# EAGLE design TimerSchematicV1 (EAGLE 9.6.2)
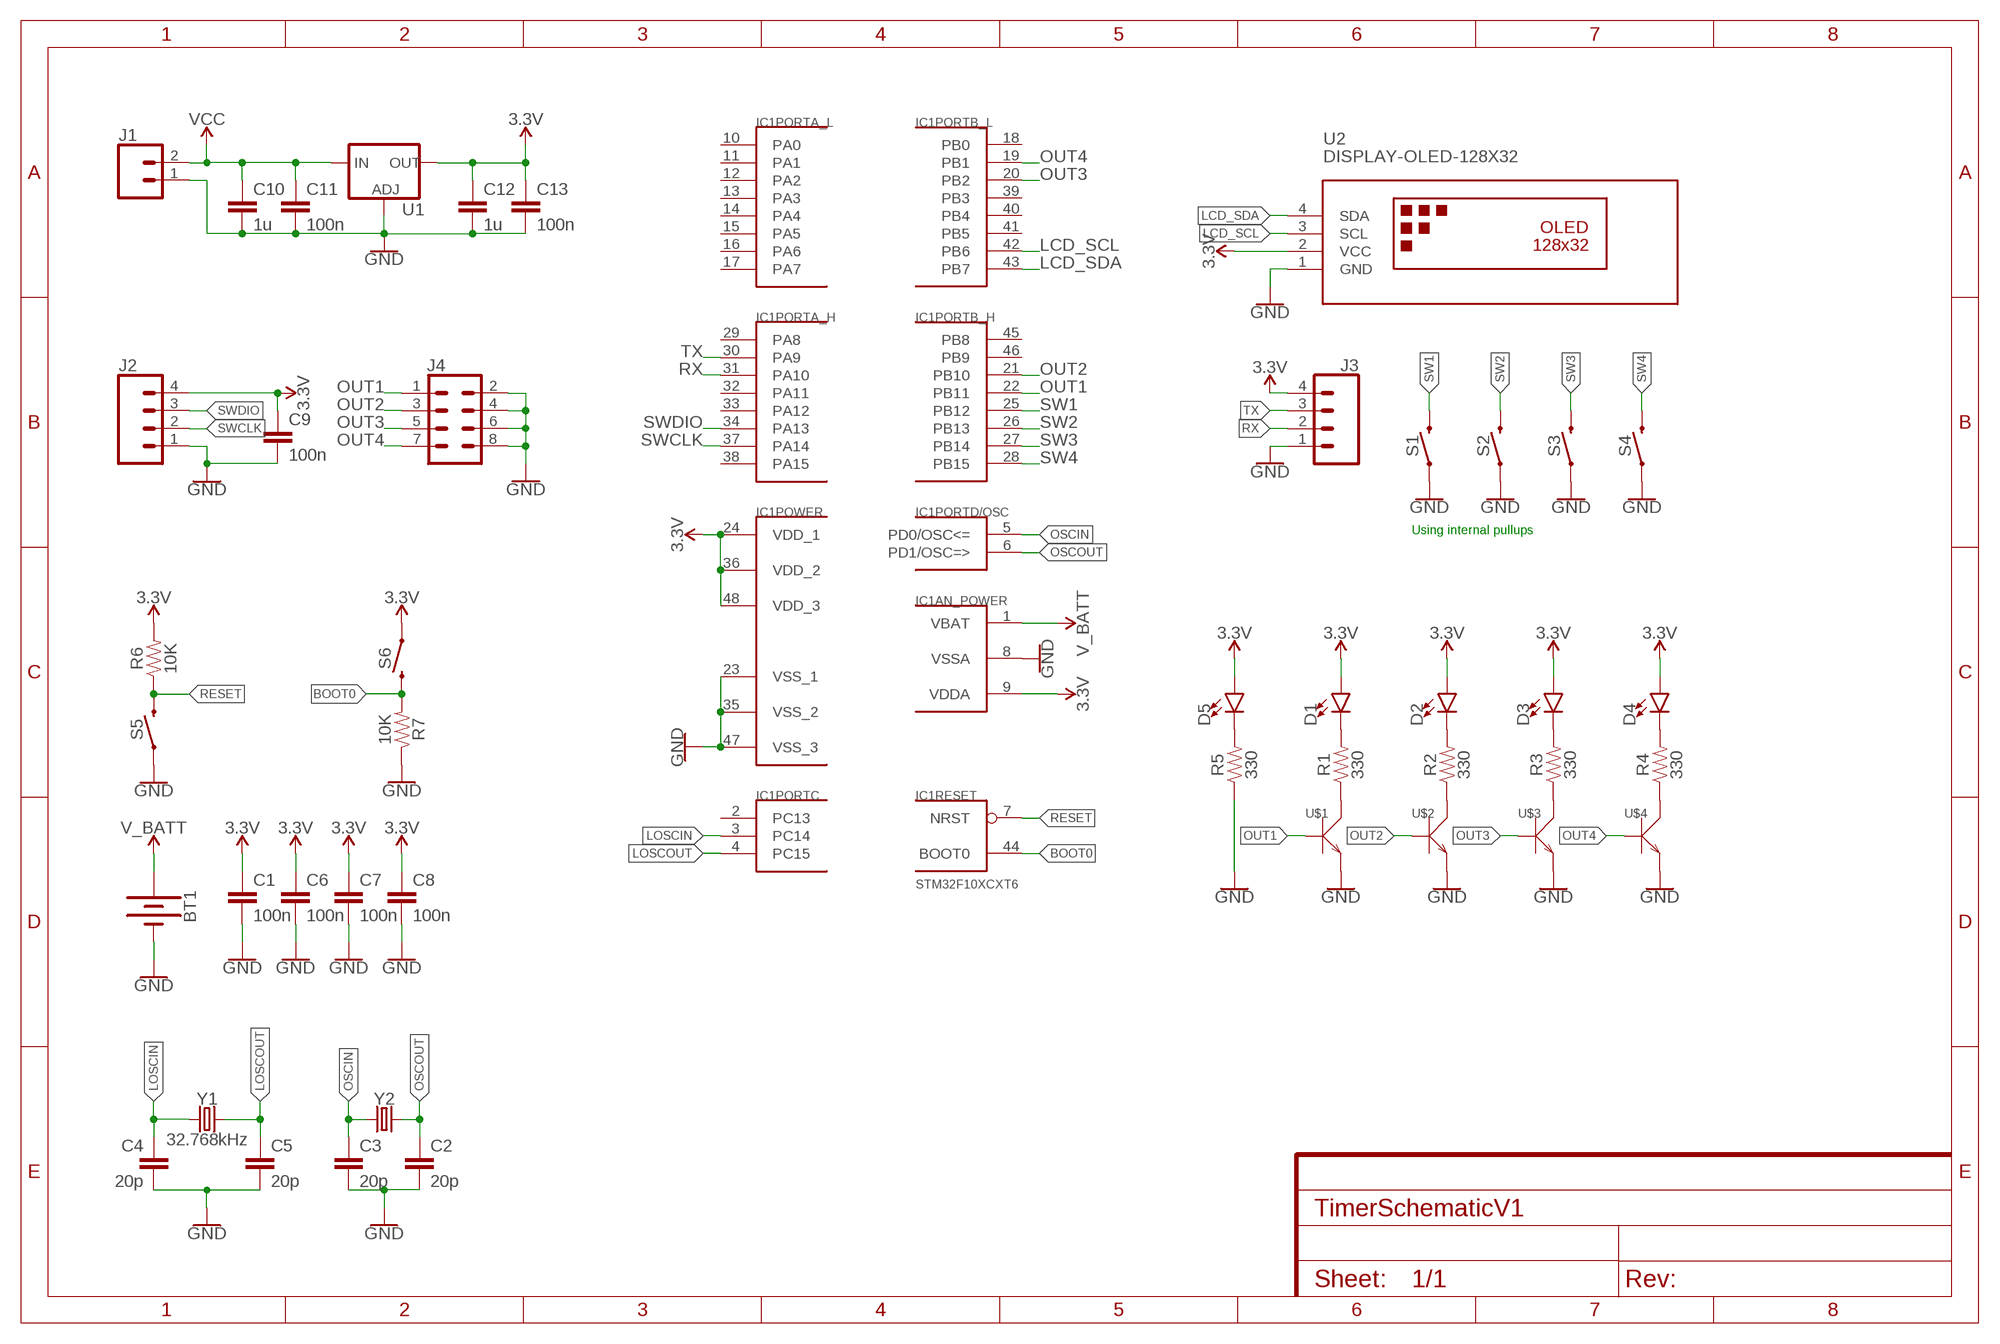
[diagram p0: schematic, sheet 1]

## Parts
BT1  BATTERY-20MM_PTH  [BATTCOM_20MM_PTH]
C1  100n  CAP-1206  [1206]
C2  20p  CAP-1206  [1206]
C3  20p  CAP-1206  [1206]
C4  20p  CAP-1206  [1206]
C5  20p  CAP-1206  [1206]
C6  100n  CAP-1206  [1206]
C7  100n  CAP-1206  [1206]
C8  100n  CAP-1206  [1206]
C9  100n  CAP-1206  [1206]
C10  1u  CAP-1206  [1206]
C11  100n  CAP-1206  [1206]
C12  1u  CAP-1206  [1206]
C13  100n  CAP-1206  [1206]
D1  LED1206  [LED-1206]
D2  LED1206  [LED-1206]
D3  LED1206  [LED-1206]
D4  LED1206  [LED-1206]
D5  LED1206  [LED-1206]
IC1  STM32F10XCXT6  [TQFP48]
J1  CONN_02  [1X02]
J2  CONN_04PTH  [1X04]
J3  CONN_04PTH  [1X04]
J4  CONN_04X2  [2X4]
R1  330  RESISTOR1206  [1206]
R2  330  RESISTOR1206  [1206]
R3  330  RESISTOR1206  [1206]
R4  330  RESISTOR1206  [1206]
R5  330  RESISTOR1206  [1206]
R6  10K  RESISTOR1206  [1206]
R7  10K  RESISTOR1206  [1206]
S1  MOMENTARY-SWITCH-SPST-PTH-6.0MM-KIT  [TACTILE_SWITCH_PTH_6.0MM_KIT]
S2  MOMENTARY-SWITCH-SPST-PTH-6.0MM-KIT  [TACTILE_SWITCH_PTH_6.0MM_KIT]
S3  MOMENTARY-SWITCH-SPST-PTH-6.0MM-KIT  [TACTILE_SWITCH_PTH_6.0MM_KIT]
S4  MOMENTARY-SWITCH-SPST-PTH-6.0MM-KIT  [TACTILE_SWITCH_PTH_6.0MM_KIT]
S5  MOMENTARY-SWITCH-SPST-SMD-6.0X3.5MM  [TACTILE_SWITCH_SMD_6.0X3.5MM]
S6  MOMENTARY-SWITCH-SPST-SMD-6.0X3.5MM  [TACTILE_SWITCH_SMD_6.0X3.5MM]
U1  V_REG_LM1117SOT223  [SOT223]
U2  DISPLAY-OLED-128X32  [DISPLAY-OLED-128X32]
U$1  MMBT3904LT1G  SMD-TRANSISTORS-NPN-40V-200MA-MMBT3904LT1G(SOT-23)  [SOT-23]
U$2  MMBT3904LT1G  SMD-TRANSISTORS-NPN-40V-200MA-MMBT3904LT1G(SOT-23)  [SOT-23]
U$3  MMBT3904LT1G  SMD-TRANSISTORS-NPN-40V-200MA-MMBT3904LT1G(SOT-23)  [SOT-23]
U$4  MMBT3904LT1G  SMD-TRANSISTORS-NPN-40V-200MA-MMBT3904LT1G(SOT-23)  [SOT-23]
Y1  32.768kHz  CRYSTAL-32.768KHZPTH-2X6-KIT  [CRYSTAL-PTH-2X6-CYL-KIT]
Y2  CRYSTALSMD-HC49UP  [HC49UP]

## Nets
3.3V: C1.1 C6.1 C7.1 C8.1 C9.1 C12.1 C13.1 D1.A D2.A D3.A D4.A D5.A IC1.9(AN_POWER:VDDA) IC1.24(POWER:VDD_1) IC1.36(POWER:VDD_2) IC1.48(POWER:VDD_3) J2.4 J3.4 R6.2 S6.1 U1.2(OUT) U1.4(OUT) U2.2(VCC)
BOOT0: IC1.44(RESET:BOOT0) R7.2 S6.2
GND: BT1.2(-) C1.2 C2.2 C3.2 C4.2 C5.2 C6.2 C7.2 C8.2 C9.2 C10.2 C11.2 C12.2 C13.2 IC1.8(AN_POWER:VSSA) IC1.23(POWER:VSS_1) IC1.35(POWER:VSS_2) IC1.47(POWER:VSS_3) J1.1 J2.1 J3.1 J4.2 J4.4 J4.6 J4.8 R5.1 R7.1 S1.1 S2.1 S3.1 S4.1 S5.1 U1.1(ADJ) U2.1(GND) U$1.2(E) U$2.2(E) U$3.2(E) U$4.2(E)
LCD_SCL: IC1.42(PORTB_L:PB6) U2.3(SCL)
LCD_SDA: IC1.43(PORTB_L:PB7) U2.4(SDA)
LOSCIN: C4.1 IC1.3(PORTC:PC14) Y1.1
LOSCOUT: C5.1 IC1.4(PORTC:PC15) Y1.2
N$1: D1.C R1.2
N$2: D2.C R2.2
N$3: D3.C R3.2
N$4: D4.C R4.2
N$5: D5.C R5.2
N$6: R1.1 U$1.3(C)
N$7: R2.1 U$2.3(C)
N$8: R3.1 U$3.3(C)
N$9: R4.1 U$4.3(C)
OSCIN: C3.1 IC1.5(PORTD/OSC:PD0/OSC<=) Y2.1
OSCOUT: C2.1 IC1.6(PORTD/OSC:PD1/OSC=>) Y2.2
OUT1: IC1.22(PORTB_H:PB11) J4.1 U$1.1(B)
OUT2: IC1.21(PORTB_H:PB10) J4.3 U$2.1(B)
OUT3: IC1.20(PORTB_L:PB2) J4.5 U$3.1(B)
OUT4: IC1.19(PORTB_L:PB1) J4.7 U$4.1(B)
RESET: IC1.7(RESET:NRST) R6.1 S5.2
RX: IC1.31(PORTA_H:PA10) J3.2
SW1: IC1.25(PORTB_H:PB12) S1.3
SW2: IC1.26(PORTB_H:PB13) S2.3
SW3: IC1.27(PORTB_H:PB14) S3.3
SW4: IC1.28(PORTB_H:PB15) S4.3
SWCLK: IC1.37(PORTA_H:PA14) J2.2
SWDIO: IC1.34(PORTA_H:PA13) J2.3
TX: IC1.30(PORTA_H:PA9) J3.3
V_BATT: BT1.1(+) IC1.1(AN_POWER:VBAT)
VCC: C10.1 C11.1 J1.2 U1.3(IN)
Unconnected: IC1.2(PORTC:PC13) IC1.10(PORTA_L:PA0) IC1.11(PORTA_L:PA1) IC1.12(PORTA_L:PA2) IC1.13(PORTA_L:PA3) IC1.14(PORTA_L:PA4) IC1.15(PORTA_L:PA5) IC1.16(PORTA_L:PA6) IC1.17(PORTA_L:PA7) IC1.18(PORTB_L:PB0) IC1.29(PORTA_H:PA8) IC1.32(PORTA_H:PA11) IC1.33(PORTA_H:PA12) IC1.38(PORTA_H:PA15) IC1.39(PORTB_L:PB3) IC1.40(PORTB_L:PB4) IC1.41(PORTB_L:PB5) IC1.45(PORTB_H:PB8) IC1.46(PORTB_H:PB9)

## Notes on the sheet
- Using internal pullups

## Library data of the parts
BT1 = SparkFun-Batteries:BATTERY: Battery - Single Cell A variety of battery chemistries, sizes, and footprints. Device List: 20MM_PTH - Coin Cell Battery Holder - 20mm (PTH) <https://www.sparkfun.com/products/783> 20MM_PTH_KIT- Coin Cell battery Holder - 20 mm (PTH) <http://www.sparkfun.com/products/783>kit version with special mask 6.8MM_PTH - Coin Cell Battery Holder - 6.8MM(SMD) <https://www.digikey.com/product-detail/en/seiko-instruments/MS621FE-FL11E/728-1057-ND/1889208?WT.srch=1&gclid=CNOQ5a6LzdQCFZS2wAodXCkE0g> 12MM_SMD - Coin Cell Battery Holder - 12mm (SMD) <https://www.sparkfun.com/products/10592> 12MM_PTH - Coin Cell Battery Holder - 12mm (PTH) <https://www.sparkfun.com/products/7948> 20MM_SMD - 20mm Coin Cell Battery Holder (SMD) (2 legs) Used on the Big Time Watch Kit <https://www.sparkfun.com/products/11734> 20MM_SMD_4LEGS - Coin Cell Battery Holder - 20mm (SMD) <https://www.sparkfun.com/products/11892> 20MM_SMD_4LEGS_OVERPASTE - Coin Cell Battery Holder - 20mm (SMD) <https://www.sparkfun.com/products/11892> (Over-paste on the legs) 24.5MM_PTH - Coin Cell Battery Holder - 24.5mm (PTH) <https://www.sparkfun.com/products/8863> 9V - 9V Battery Holder - PC Mount Used on the SparkFun SparkPunk Sound Kit <https://www.sparkfun.com/products/11177> and SparkFun SparkPunk Sequencer Kit <https://www.sparkfun.com/products/12707> 18650 - Battery Holder - 18650 (PTH) <https://www.sparkfun.com/products/13113> AA - Battery Holder - 1xAA (PTH) <https://www.sparkfun.com/products/7949> AAA - Battery Holder - 1xAAA (PTH) <https://www.sparkfun.com/products/12718> AA_KIT - Battery Holder - 1xAA (PTH) <https://www.sparkfun.com/products/7949> Special kit package - pads only have exposed copper on one side of the board. AAA_KIT - Battery Holder - 1xAAA (PTH) <https://www.sparkfun.com/products/12718> Special kit package - pads only have exposed copper on one side of the board.; PROD_ID: BATT-09031; SF_SKU: PRT-00783
C1-C13 = SparkFun-Capacitors:CAP
D1-D5 = SparkFun-LED:LED: LED (Generic) Standard schematic elements and footprints for 5mm, 3mm, 1206, and 0603 sized LEDs. Generic LEDs with no color specified.
IC1 = stm32:STM32F10XCXT6: ST STM32F101/103 48pin LQFP
J1 = SparkFun-Connectors:CONN_02: Multi connection point. Often used as Generic Header-pin footprint for 0.1 inch spaced/style header connections On any of the 0.1 inch spaced packages, you can populate with these: Break Away Headers - Straight <https://www.sparkfun.com/products/116> (PRT-00116) Break Away Male Headers - Right Angle <https://www.sparkfun.com/products/553> (PRT-00553) Female Headers <https://www.sparkfun.com/products/115> (PRT-00115) Break Away Headers - Machine Pin <https://www.sparkfun.com/products/117> (PRT-00117) Break Away Female Headers - Swiss Machine Pin <https://www.sparkfun.com/products/743> (PRT-00743) For SCREWTERMINALS and SPRING TERMINALS visit here: Screw Terimnals on SparkFun.com <https://www.sparkfun.com/search/results?term=Screw+Terminals> (5mm/3.5mm/2.54mm spacing) This device is also useful as a general connection point to wire up your design to another part of your project. Our various solder wires solder well into these plated through hole pads. Hook-Up Wire - Assortment (Stranded, 22 AWG) <https://www.sparkfun.com/products/11375> (PRT-11375) Hook-Up Wire - Assortment (Solid Core, 22 AWG) <https://www.sparkfun.com/products/11367> (PRT-11367) View the entire wire category on our website here <https://www.sparkfun.com/categories/141> Special notes: Molex polarized connector foot print use with: PRT-08233 with associated crimp pins and housings. 2.54_SCREWTERM for use with PRT-10571. 3.5mm Screw Terminal footprints for PRT-08084 5mm Screw Terminal footprints for use with PRT-08432
J2 J3 = SparkFun-Connectors:CONN_04: Multi connection point. Often used as Generic Header-pin footprint for 0.1 inch spaced/style header connections On any of the 0.1 inch spaced packages, you can populate with these: Break Away Headers - Straight <https://www.sparkfun.com/products/116> (PRT-00116) Break Away Male Headers - Right Angle <https://www.sparkfun.com/products/553> (PRT-00553) Female Headers <https://www.sparkfun.com/products/115> (PRT-00115) Break Away Headers - Machine Pin <https://www.sparkfun.com/products/117> (PRT-00117) Break Away Female Headers - Swiss Machine Pin <https://www.sparkfun.com/products/743> (PRT-00743) For SCREWTERMINALS and SPRING TERMINALS visit here: Screw Terimnals on SparkFun.com <https://www.sparkfun.com/search/results?term=Screw+Terminals> (5mm/3.5mm/2.54mm spacing) This device is also useful as a general connection point to wire up your design to another part of your project. Our various solder wires solder well into these plated through hole pads. Hook-Up Wire - Assortment (Stranded, 22 AWG) <https://www.sparkfun.com/products/11375> (PRT-11375) Hook-Up Wire - Assortment (Solid Core, 22 AWG) <https://www.sparkfun.com/products/11367> (PRT-11367) View the entire wire category on our website here <https://www.sparkfun.com/categories/141> Special notes: Molex polarized connector foot print use with SKU : PRT-08231 with associated crimp pins and housings. 1MM SMD Version SKU: PRT-10208; PROD_ID: CONN-09696
J4 = SparkFun-Connectors:CONN_04X2: Multi connection point. Often used as Generic Header-pin footprint for 0.1 inch spaced/style header connections On any of the 0.1 inch spaced packages, you can populate with these: Break Away Headers - Straight <https://www.sparkfun.com/products/116> (PRT-00116) Break Away Male Headers - Right Angle <https://www.sparkfun.com/products/553> (PRT-00553) Female Headers <https://www.sparkfun.com/products/115> (PRT-00115) Break Away Headers - Machine Pin <https://www.sparkfun.com/products/117> (PRT-00117) Break Away Female Headers - Swiss Machine Pin <https://www.sparkfun.com/products/743> (PRT-00743)
R1-R7 = SparkFun-Resistors:RESISTOR: Generic Resistor Package
S1-S4 = SparkFun-Switches:MOMENTARY-SWITCH-SPST: Momentary Switch (Pushbutton) - SPST Normally-open (NO) SPST momentary switches (buttons, pushbuttons). Variants PTH-12MM - 12mm square, through-hole Momentary Pushbutton Switch - 12mm Square <https://www.sparkfun.com/products/9190> (COM-09190) PTH-6.0MM, PTH-6.0MM-KIT - 6.0mm square, through-hole Mini Pushbutton Switch <https://www.sparkfun.com/products/97> (COM-00097) KIT package intended for soldering kit's - only one side of pads' copper is exposed. PTH-RIGHT-ANGLE-KIT - Right-angle, through-hole Right Angle Tactile Button <https://www.sparkfun.com/products/10791> - Used on SparkFun BigTime Watch Kit <https://www.sparkfun.com/products/11734> SMD-12MM - 12mm square, surface-mount Tactile Button - SMD (12mm) <https://www.sparkfun.com/products/12993> (COM-12993) Used on SparkFun PicoBoard <https://www.sparkfun.com/products/11888> SMD-4.5MM - 4.5mm Square Trackball Switch Used on SparkFun Blackberry Trackballer Breakout <https://www.sparkfun.com/products/13169> SMD-4.6MMX2.8MM - 4.60mm x 2.80mm, surface mount Used on SparkFun Pro Micro - RP2040 <https://www.sparkfun.com/products/17717> SMD-5.2MM, SMD-5.2-REDUNDANT - 5.2mm square, surface-mount Mini Pushbutton Switch - SMD <https://www.sparkfun.com/products/8720> (COM-08720) Used on Arduino Pro Mini <https://www.sparkfun.com/products/11114> REDUNDANT package connects both switch circuits together SMD-6.0X3.5MM - 6.0 x 3.5mm, surface mount Momentary Reset Switch SMD <https://www.sparkfun.com/products/8229> (COM-08229) SMD-6.2MM-TALL - 6.2mm square, surface mount Tactile Button - SMD (6mm) <https://www.sparkfun.com/products/12992> Used on SparkFun Digital Sandbox <https://www.sparkfun.com/products/12651> SMD-RIGHT-ANGLE - Right-angle, surface mount Used on SparkFun Block for Intel® Edison - Arduino <https://www.sparkfun.com/products/13036>; PROD_ID: SWCH-08441; SF_SKU: COM-00097
S5 S6 = SparkFun-Switches:MOMENTARY-SWITCH-SPST: Momentary Switch (Pushbutton) - SPST Normally-open (NO) SPST momentary switches (buttons, pushbuttons). Variants PTH-12MM - 12mm square, through-hole Momentary Pushbutton Switch - 12mm Square <https://www.sparkfun.com/products/9190> (COM-09190) PTH-6.0MM, PTH-6.0MM-KIT - 6.0mm square, through-hole Mini Pushbutton Switch <https://www.sparkfun.com/products/97> (COM-00097) KIT package intended for soldering kit's - only one side of pads' copper is exposed. PTH-RIGHT-ANGLE-KIT - Right-angle, through-hole Right Angle Tactile Button <https://www.sparkfun.com/products/10791> - Used on SparkFun BigTime Watch Kit <https://www.sparkfun.com/products/11734> SMD-12MM - 12mm square, surface-mount Tactile Button - SMD (12mm) <https://www.sparkfun.com/products/12993> (COM-12993) Used on SparkFun PicoBoard <https://www.sparkfun.com/products/11888> SMD-4.5MM - 4.5mm Square Trackball Switch Used on SparkFun Blackberry Trackballer Breakout <https://www.sparkfun.com/products/13169> SMD-4.6MMX2.8MM - 4.60mm x 2.80mm, surface mount Used on SparkFun Pro Micro - RP2040 <https://www.sparkfun.com/products/17717> SMD-5.2MM, SMD-5.2-REDUNDANT - 5.2mm square, surface-mount Mini Pushbutton Switch - SMD <https://www.sparkfun.com/products/8720> (COM-08720) Used on Arduino Pro Mini <https://www.sparkfun.com/products/11114> REDUNDANT package connects both switch circuits together SMD-6.0X3.5MM - 6.0 x 3.5mm, surface mount Momentary Reset Switch SMD <https://www.sparkfun.com/products/8229> (COM-08229) SMD-6.2MM-TALL - 6.2mm square, surface mount Tactile Button - SMD (6mm) <https://www.sparkfun.com/products/12992> Used on SparkFun Digital Sandbox <https://www.sparkfun.com/products/12651> SMD-RIGHT-ANGLE - Right-angle, surface mount Used on SparkFun Block for Intel® Edison - Arduino <https://www.sparkfun.com/products/13036>; PROD_ID: SWCH-14278; SF_SKU: COM-08229
U1 = SparkFun-IC-Power:V_REG_LM1117: Voltage Regulator LM1117 Standard adjustable voltage regulator but in SMD form. Spark Fun Electronics SKU : COM-00595; PROD_ID: VREG-08170
U2 = diy-modules:DISPLAY-OLED-128X32: 128x32 Dot Matrix OLED Module with I2C interface based on SSD1306 chip More details available here: http://www.tinyosshop.com/index.php?route=product/product&product_id=953 Schematic available here: http://www.tinyosshop.com/datasheet/OLED%2012832.pdf SSD1306 datasheet: https://cdn-shop.adafruit.com/datasheets/SSD1306.pdf Click here to find device on ebay.com <http://www.ebay.com/sch/oled+display+128x32+i2c>
U$1-U$4 = Seeed-Transistor:SMD-TRANSISTORS-NPN-40V-200MA-MMBT3904LT1G(SOT-23): 305010013; MPN: MMBT3904LT1G
Y1 = SparkFun-Clocks:CRYSTAL-32.768KHZ: 32.768kHz Crystal Frequency: 32.768kHz Frequency Stability: ±20ppm Load Capacitance: 12.5pF (PTH-2X6 & SMD-3.2X1.5), 6pF (SMD-2X6) SparkFun Products: SparkFun BigTime Watch Kit <https://www.sparkfun.com/products/11734> SparkFun nRF52832 Breakout <https://www.sparkfun.com/products/13990> SparkFun Real Time Clock Module <https://www.sparkfun.com/products/12708>; PROD_ID: XTAL-10112
Y2 = SparkFun-Clocks:CRYSTAL: Crystals (Generic) These are passive quartz crystals, which can be used as a clock source for a microcontroller. Crystal's are two-terminal devices. They require external "load" capacitors to generate an oscillating signal.

## Board
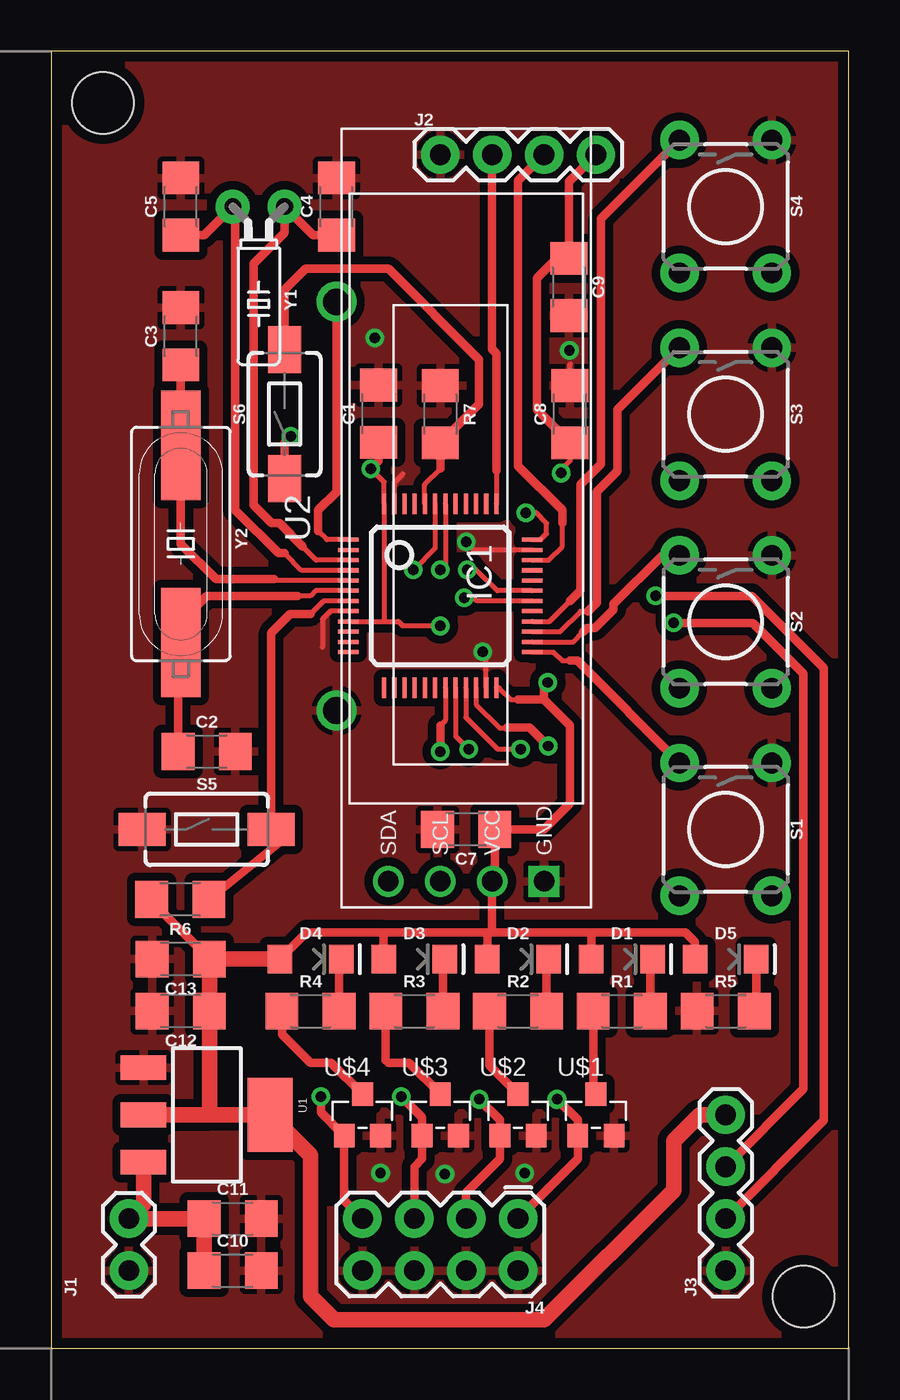
[diagram p1: board, top side]
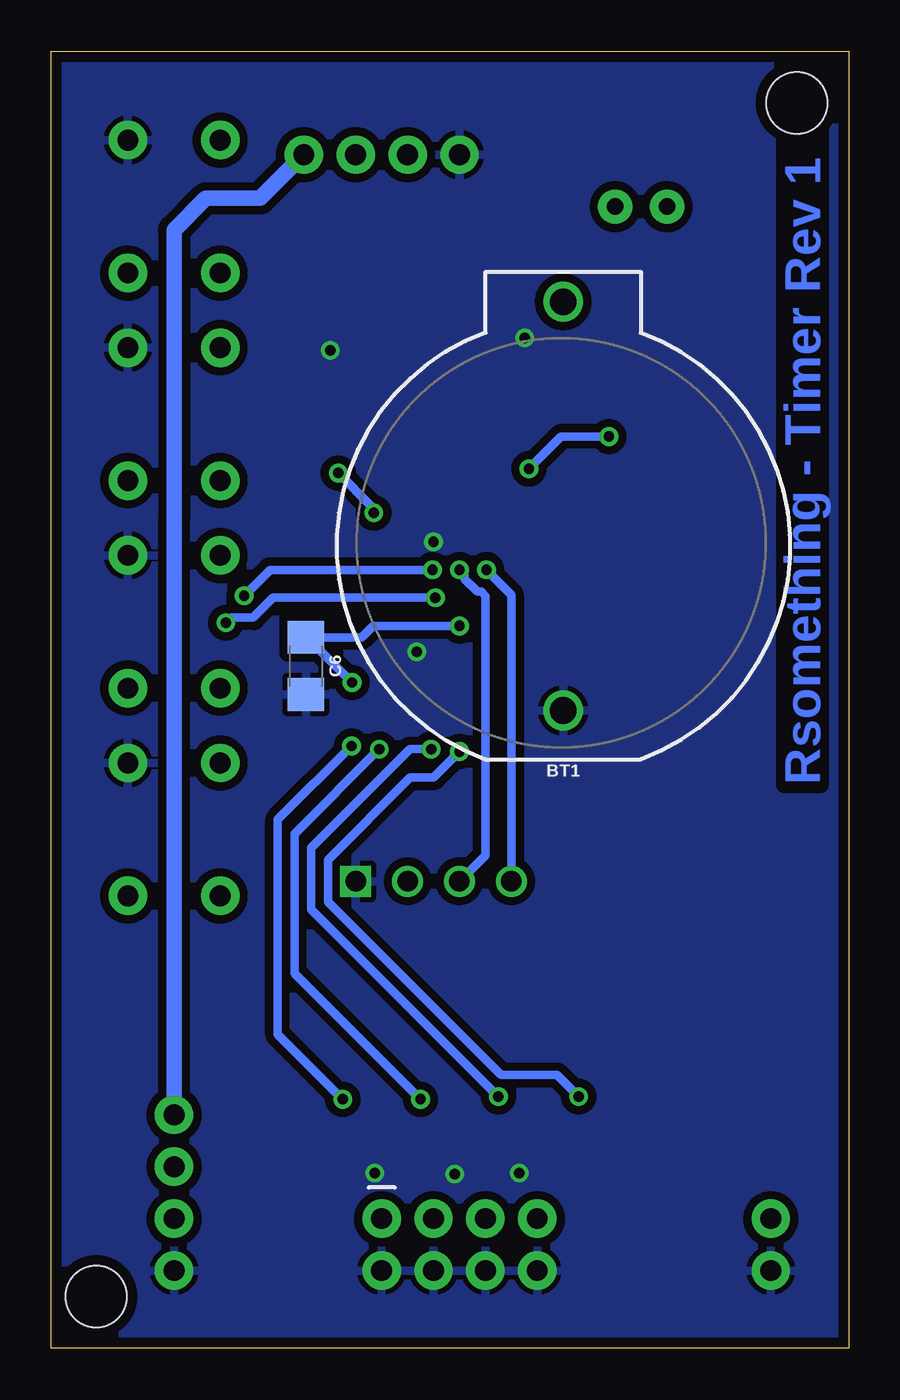
[diagram p2: board, bottom side, seen from below]

Size 39.04 x 63.49 mm. Coordinates in mm from the lower left corner, seen from the top.
Outline: 0,0 39.04,0 39.04,63.49 0,63.49 0,0
Copper layers (1*16): Top 0.035mm / dielectric 1.5mm / Bottom 0.035mm
Design rules "default *": minimum track width 6mil, minimum drill 0.35mm, track to track 16mil, track to pad 16mil, pad to pad 16mil, via to via 16mil, smd to smd 10mil, copper to edge 20mil, drill to drill 6mil, minimum pad ring 10mil, minimum via ring 8mil, stop-mask expansion 4mil, vias tented up to drill 0mil, thermal gap 10mil
Holes 3 mm at 36.83,2.54 2.54,60.96

### Footprints (pad centres in the part's own frame; a part is rotated, then mirrored left to right if it is on the bottom)
BATTCOM_20MM_PTH = drill 1.3: 1 11.85,0; 2 -8.15,0
1206 = smd 1.6 x 1.8: 1 -1.4,0; 2 1.4,0
LED-1206 = smd 1.2 x 1.4: A -1.5,0; C 1.5,0
TQFP48 = smd 0.2 x 1: 1 -2.75,-4.5; 2 -2.25,-4.5; 3 -1.75,-4.5; 4 -1.25,-4.5; 5 -0.75,-4.5; 6 -0.25,-4.5; 7 0.25,-4.5; 8 0.75,-4.5; 9 1.25,-4.5; 10 1.75,-4.5; 11 2.25,-4.5; 12 2.75,-4.5; 25 2.75,4.5; 26 2.25,4.5; 27 1.75,4.5; 28 1.25,4.5; 29 0.75,4.5; 30 0.25,4.5; 31 -0.25,4.5; 32 -0.75,4.5; 33 -1.25,4.5; 34 -1.75,4.5; 35 -2.25,4.5; 36 -2.75,4.5 | smd 1 x 0.2: 13 4.5,-2.75; 14 4.5,-2.25; 15 4.5,-1.75; 16 4.5,-1.25; 17 4.5,-0.75; 18 4.5,-0.25; 19 4.5,0.25; 20 4.5,0.75; 21 4.5,1.25; 22 4.5,1.75; 23 4.5,2.25; 24 4.5,2.75; 37 -4.5,2.75; 38 -4.5,2.25; 39 -4.5,1.75; 40 -4.5,1.25; 41 -4.5,0.75; 42 -4.5,0.25; 43 -4.5,-0.25; 44 -4.5,-0.75; 45 -4.5,-1.25; 46 -4.5,-1.75; 47 -4.5,-2.25; 48 -4.5,-2.75
1X02 = drill 1.016 pad 1.88: 1 0,0; 2 2.54,0
1X04 = drill 1.016 pad 1.88: 1 0,0; 2 2.54,0; 3 5.08,0; 4 7.62,0
2X4 = drill 1.016 pad 1.88: 1 -3.81,-1.27; 2 -3.81,1.27; 3 -1.27,-1.27; 4 -1.27,1.27; 5 1.27,-1.27; 6 1.27,1.27; 7 3.81,-1.27; 8 3.81,1.27
TACTILE_SWITCH_PTH_6.0MM_KIT = drill 1.016 pad 1.88: 1 -3.251,2.261; 2 3.251,2.261; 3 -3.251,-2.261; 4 3.251,-2.261
TACTILE_SWITCH_SMD_6.0X3.5MM = smd 2.3 x 1.6: 1 -3.15,0; 2 3.15,0
SOT223 = smd 1.219 x 2.235: 1 -2.311,-3.099; 2 0,-3.099; 3 2.311,-3.099 | smd 3.6 x 2.2: 4 0,3.099
DISPLAY-OLED-128X32 = drill 1 square: 1 -17.78,-3.81 | drill 1: 2 -17.78,-1.27; 3 -17.78,1.27; 4 -17.78,3.81
SOT-23 = smd 1.016 x 1.143: 1 -0.889,-1.016; 2 0.889,-1.016; 3 0,1.016
CRYSTAL-PTH-2X6-CYL-KIT = drill 0.813 pad 1.676: 1 -1.27,0; 2 1.27,0
HC49UP = smd 5.334 x 1.93: 1 -4.826,0; 2 4.826,0

### Placement (x,y rotation side)
BT1  13.97,39.37 90 bottom
C1  16.03,45.75 90 top
C2  7.62,29.21 0 top
C3  6.35,49.53 90 top
C4  13.97,55.88 90 top
C5  6.35,55.88 90 top
C6  26.57,33.4 270 bottom
C7  20.32,25.4 180 top
C8  25.4,45.72 90 top
C9  25.35,51.94 270 top
C10  8.89,3.81 0 top
C11  8.89,6.35 0 top
C12  6.35,16.51 180 top
C13  6.35,19.05 180 top
D1  27.94,19.05 0 top
D2  22.86,19.05 0 top
D3  17.78,19.05 0 top
D4  12.7,19.05 0 top
D5  33.02,19.05 0 top
IC1  19.05,36.83 270 top
J1  3.81,3.81 90 top
J2  19.05,58.42 0 top
J3  33.02,3.81 90 top
J4  19.05,5.08 180 top
R1  27.94,16.51 0 top
R2  22.86,16.51 0 top
R3  17.78,16.51 0 top
R4  12.7,16.51 0 top
R5  33.02,16.51 0 top
R6  6.32,21.97 180 top
R7  19.05,45.72 270 top
S1  33.02,25.4 270 top
S2  33.02,35.56 270 top
S3  33.02,45.72 270 top
S4  33.02,55.88 270 top
S5  7.62,25.4 0 top
S6  11.43,45.72 90 top
U1  7.62,11.43 270 top
U2  20.32,40.64 90 top
U$1  26.67,11.43 0 top
U$2  22.86,11.43 0 top
U$3  19.05,11.43 0 top
U$4  15.24,11.43 0 top
Y1  10.16,55.88 180 top
Y2  6.35,39.37 270 top

### Tracks (layer width: path | path; a pad name or v marks a point on that pad's centre or on a via)
3.3V  (via drill 0.51)
  Top 0.254: C8.1 25.4,43.43 24.89,42.93 v24.98,42.84 | IC1.36 23.96,39.58 24.26,39.88 24.26,40.39 23.75,40.89 v23.24,40.89 | 22.86,31.75 22.51,31.75 21.93,32.33 IC1.24 | IC1.9 16.31,35.58 | v15.65,43.05 16.3,42.4 IC1.48 16.3,35.59 16.31,35.58 | v19.05,35.36 17.22,35.36 17,35.58 16.31,35.58
  Top 0.406: J2.4 25.35,57.1 C9.1 24.74,53.34 23.77,52.38 23.77,45.95 C8.1 | 24.13,31.75 25.4,30.48 25.4,26.67 24.13,25.4 C7.1 21.72,22.99 U2.2 21.59,20.36 | 24.13,31.75 22.86,31.75 | 21.59,19.28 D2.A 21.36,20.33 21.39,20.36 | C13.1 4.92,21.88 R6.2 | D5.A 31.52,19.89 31.05,20.36 26.47,20.36 | 26.47,20.36 21.59,20.36 | 16.15,20.36 21.39,20.36 | 16.15,20.36 12.51,20.36 D4.A | D1.A 26.44,20.33 26.47,20.36 | D3.A 16.28,20.23 16.15,20.36 | 24.13,31.75 24.13,32.41 v24.31,32.59 | S6.1 11.43,44.32 v11.73,44.63 | v15.65,43.05 16.03,43.43 C1.1 | 21.39,20.36 21.59,20.36
  Top 0.762: U1.2 7.62,11.43 | 7.62,11.43 7.75,11.56 C12.1 C13.1 D4.A | 7.62,11.43 U1.4 12.7,9.45 12.7,2.54 13.84,1.4 24.13,1.4 30.48,7.75 30.48,10.16 31.75,11.43 J3.4
  Bottom 0.406: v24.98,42.84 23.37,41.23 23.37,40.89 v23.24,40.89 | v19.05,35.36 23.29,35.36 23.85,34.8 C6.1 26.52,34.8 v24.31,32.59 | v11.73,44.63 14.07,44.63 v15.65,43.05
  Bottom 0.762: J3.4 33.02,40.54 33.02,54.74 31.47,56.29 28.8,56.29 J2.4
BOOT0
  Top 0.254: IC1.44 18.29,41.34 18.29,42.29 19.05,43.05
  Top 0.406: 19.05,43.05 R7.2 20.95,46.23 20.95,48.39 16.51,52.83 12.45,52.83 11.43,51.82 S6.2
GND  (via drill 0.51)
  Top 0.254: IC1.8 13.68,36.08 13.28,35.69 13.28,34.31 | IC1.47 16.8,42.38 17.22,42.8 | C8.2 25.4,48.18 | IC1.23 21.3,33.92 v21.13,34.09 | IC1.35 20.71,39.08 v20.32,39.47
  other vias: 16.13,8.59 19.28,8.53 23.19,8.59 25.37,48.84 15.85,49.45
  pour Top (isolate 0.305): 0,63.47 0,0 0.05,0 39.04,0 39.04,0.05 39.04,63.5 0,63.5
  pour Bottom (isolate 0.305): 0,63.42 0,-0.1 39.12,-0.1 39.12,63.42 0.08,63.42
LCD_SCL  (via drill 0.51)
  Top 0.254: IC1.42 19.3,38.35 v19.05,38.1
  Bottom 0.406: U2.3 17.78,24.13 17.78,36.83 17.98,37.03 18.17,37.03 18.8,37.66 18.8,37.85 v19.05,38.1
LCD_SDA  (via drill 0.51)
  Top 0.254: IC1.43 18.8,39.17 v17.73,38.1
  Bottom 0.406: v17.73,38.1 16.51,36.88 U2.4
LOSCIN
  Top 0.254: IC1.3 12.98,38.58 12.32,39.24
  Top 0.406: C4.1 12.83,54.48 Y1.1 11.43,54.61 9.91,53.09 9.91,41.28 10.8,40.39 11.18,40.39 12.32,39.24
LOSCOUT
  Top 0.254: IC1.4 12.26,38.08 11.43,38.91
  Top 0.406: C5.1 7.49,54.48 Y1.2 9.02,55.75 9.02,41.02 11.12,38.91 11.43,38.91
N$1
  Top 0.406: D1.C 29.34,18.95 R1.2
N$2
  Top 0.406: D2.C 24.26,18.95 R2.2
N$3
  Top 0.406: D3.C 19.18,18.95 R3.2
N$4
  Top 0.406: D4.C 14.1,18.95 R4.2
N$5
  Top 0.406: D5.C 34.52,16.61 R5.2
N$6
  Top 0.406: U$1.3 26.54,12.58 R1.1
N$7
  Top 0.406: U$2.3 21.46,13.85 R2.1
N$8
  Top 0.406: U$3.3 17.53,13.97 16.51,13.97 16.38,14.1 R3.1
N$9
  Top 0.406: U$4.3 13.72,13.97 12.7,13.97 11.3,15.37 R4.1
OSCIN
  Top 0.254: IC1.5 10.98,37.58 10.92,37.64
  Top 0.406: C3.1 Y2.1 6.35,39.37 8.08,37.64 10.92,37.64
OSCOUT
  Top 0.254: IC1.6 12.95,37.08 12.7,36.83 12.06,36.83
  Top 0.406: C2.1 6.22,34.41 | 6.22,34.41 Y2.2 | 12.06,36.83 7.62,36.83 6.22,35.43 6.22,34.41
OUT1  (via drill 0.51)
  Top 0.254: IC1.22 20.8,31.52 21.97,30.35 22.35,30.35
  Top 0.406: J4.1 25.78,9.27 U$1.1 25.78,11.18 v24.77,12.19 | 22.35,30.35 22.31,30.4 23.42,30.4 v24.33,29.48
  Bottom 0.406: v24.77,12.19 27.94,15.37 27.94,25.88 v24.33,29.48
OUT2  (via drill 0.51)
  Top 0.254: IC1.21 20.3,30.88 21.85,29.33 v22.98,29.33
  Top 0.406: v20.95,12.19 21.97,11.18 U$2.1 21.97,9.27 20.32,7.62 J4.3
  Bottom 0.406: v22.98,29.33 27.12,25.19 27.12,18.36 v20.95,12.19
OUT3  (via drill 0.51)
  Top 0.254: IC1.20 19.8,29.97 v20.44,29.33
  Top 0.406: v17.14,12.32 18.16,11.3 U$3.1 18.16,9.27 17.78,8.89 J4.5
  Bottom 0.406: v17.14,12.32 26.31,21.48 26.31,24.49 21.47,29.33 v20.44,29.33
OUT4  (via drill 0.51)
  Top 0.254: IC1.19 19.3,30.73 19.05,30.48
  Top 0.406: J4.7 14.35,7.24 U$4.1 13.21,11.56 v13.21,12.32 | v19.05,29.21 19.05,30.48
  Bottom 0.406: v13.21,12.32 14.28,13.39 17.03,13.39 25.49,21.85 25.49,23.91 21.46,27.94 20.32,27.94 v19.05,29.21
RESET
  Top 0.254: IC1.7 13.34,36.58 12.7,35.94
  Top 0.406: R6.1 11.3,24.87 S5.2 10.77,35 11.71,35.94 12.7,35.94
RX  (via drill 0.51)
  Top 0.254: v20.37,38.1 20.81,38.1 21.83,37.08 IC1.31
  Top 0.406: J3.2 37.82,11.15 37.82,33.3 34.29,36.83 v29.59,36.83
  Bottom 0.406: v20.37,38.1 28.32,38.1 v29.59,36.83
SW1
  Top 0.254: IC1.25 24.59,34.08 25.02,33.66 25.4,33.66
  Top 0.406: 25.4,33.66 25.76,33.66 S1.3
SW2
  Top 0.254: IC1.26 25.56,34.58 26.04,35.05
  Top 0.406: 26.04,35.05 26.24,35.26 26.63,35.26 27.53,36.16 27.53,36.42 29.92,38.81 S2.3
SW3
  Top 0.254: IC1.27 24.92,35.08 25.91,36.07 26.29,36.07
  Top 0.406: 26.29,36.07 26.72,36.5 26.72,41.93 27.72,42.93 27.72,45.93 S3.3
SW4
  Top 0.254: IC1.28 24.4,35.58 25.4,36.58
  Top 0.406: 25.4,36.58 25.91,37.08 25.91,42.27 26.91,43.27 26.91,55.28 S4.3
SWCLK
  Top 0.254: 21.8,42.97 IC1.37
  Top 0.406: J2.2 21.59,48.9 21.8,48.69 21.8,42.97
SWDIO
  Top 0.254: IC1.34 24.36,38.58 25.02,39.24 25.02,40.39
  Top 0.406: 25.02,40.39 25.02,41.02 22.86,43.18 22.86,57.15 J2.3
TX  (via drill 0.51)
  Top 0.254: v20.23,36.74 20.69,36.74 20.85,36.58 IC1.30
  Top 0.406: J3.3 36.83,12.7 36.83,33.02 34.34,35.51 v30.48,35.51
  Bottom 0.406: v30.48,35.51 30.23,35.76 29.15,35.76 28.18,36.74 v20.23,36.74
V_BATT
  Top 0.254: IC1.1 13.51,39.58 13.08,40.01
  Top 0.406: 13.08,40.01 13.08,41.02 13.97,41.91 BT1.1
VCC
  Top 0.762: C10.1 C11.1 J1.2 4.52,7.06 U1.3

### Text on the board
Bottom: Rsomething - Timer Rev 1